# EAGLE design mapleCUL_small-V03_012 (EAGLE 9.1.1)
MAPLE-CUx Large Version
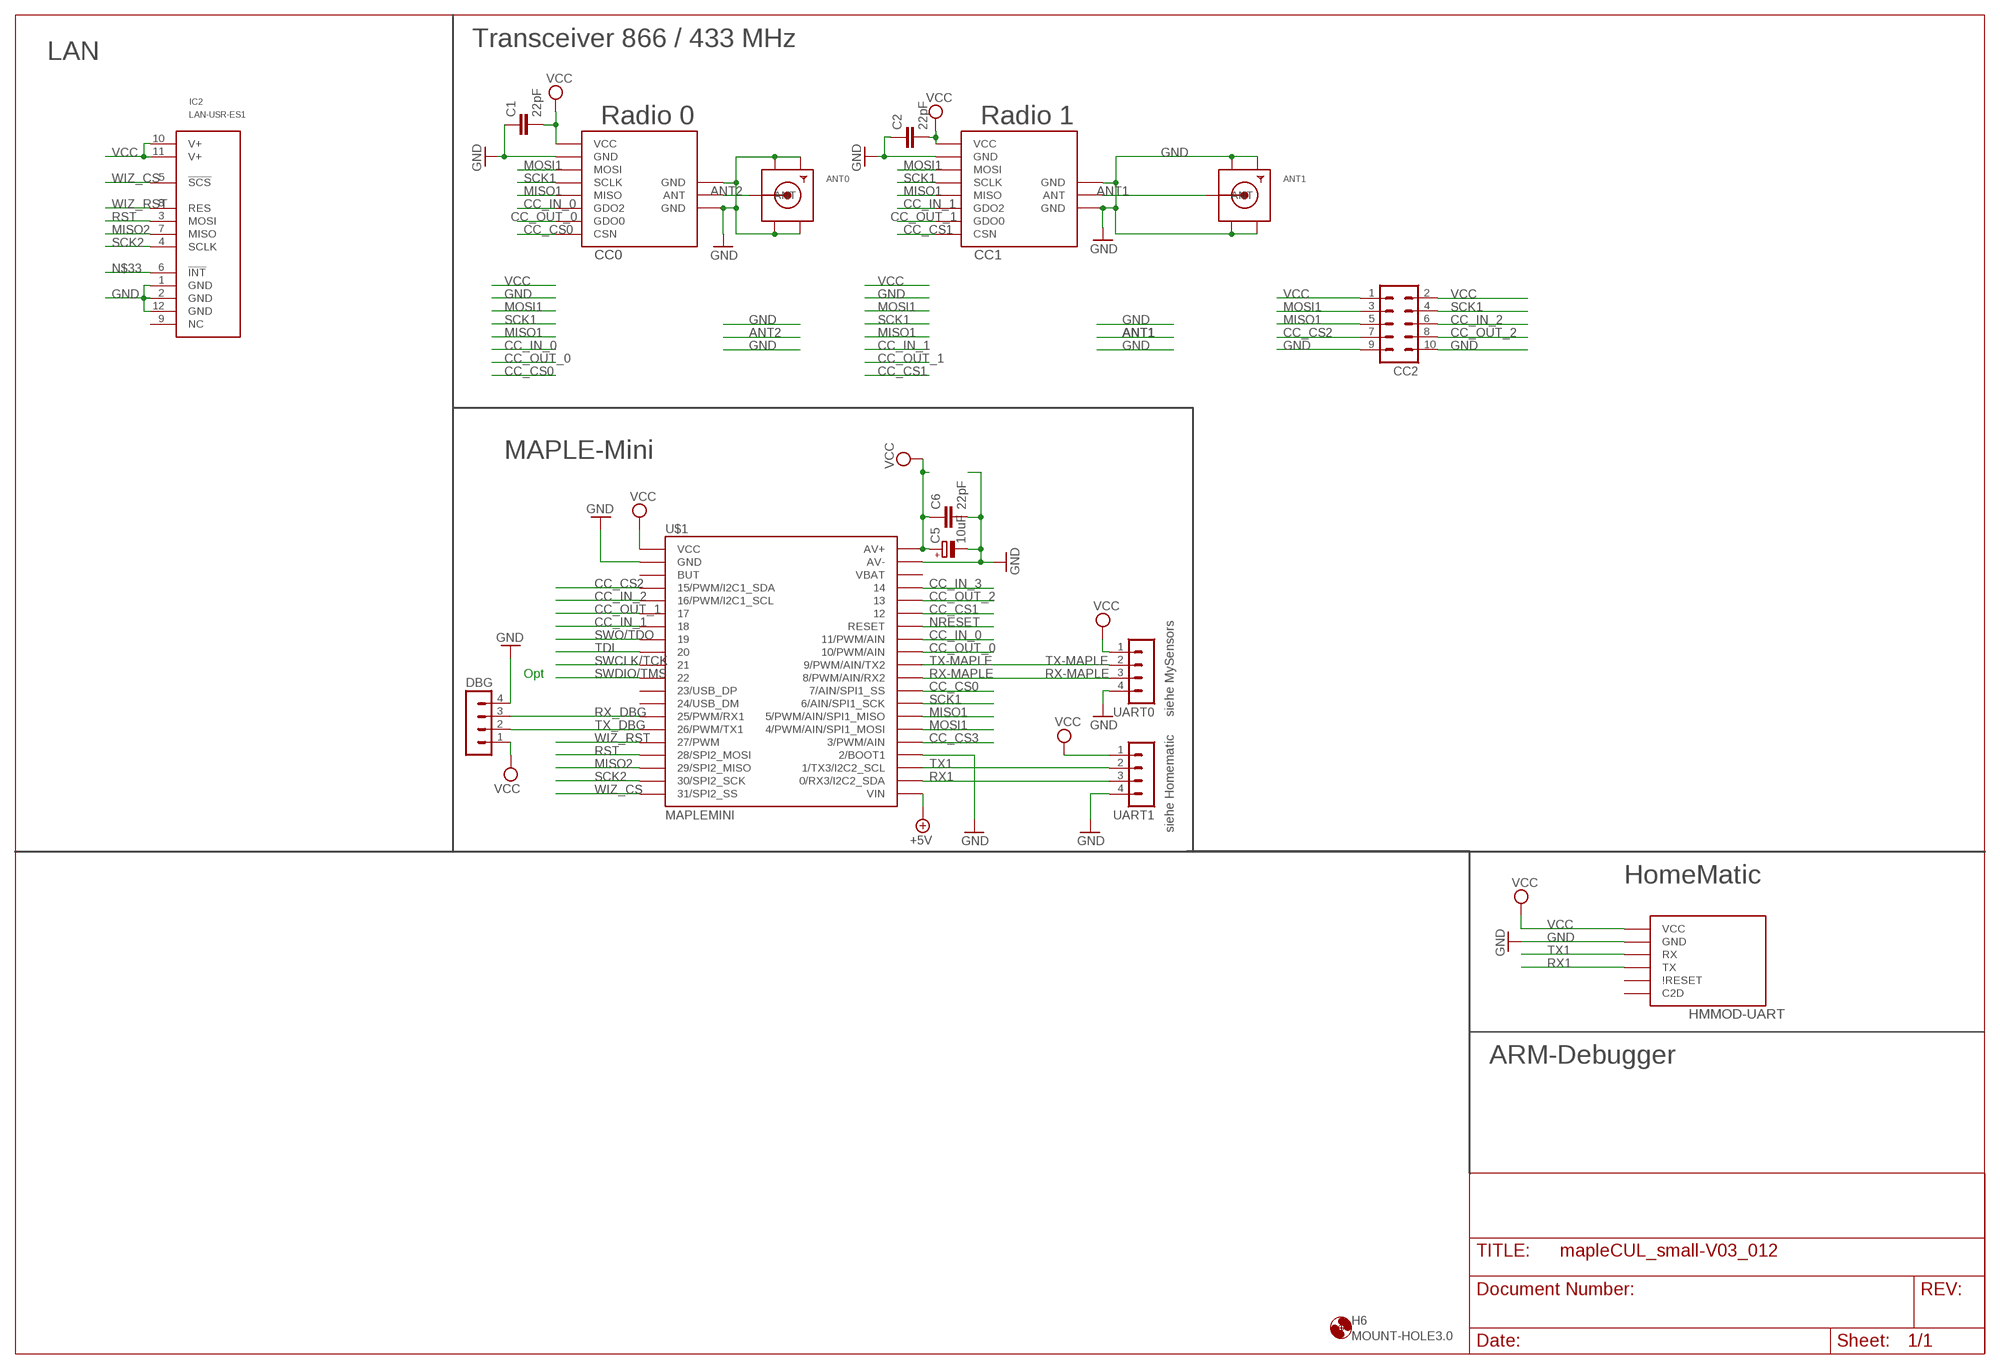
[diagram p0: schematic, sheet 1]

## Parts
ANT0  SMACONNECTOR_EDGE_UFL  [SMA_EDGELAUNCH_UFL]
ANT1  SMACONNECTOR_EDGE_UFL  [SMA_EDGELAUNCH_UFL]
C1  22pF  C-EUC0805  [C0805]
C2  22pF  C-EUC0805  [C0805]
C5  10uF  CPOL-EUR/2012-12W  [R/2012-12W]
C6  22pF  C-EUC0805  [C0805]
CC0  CC1101  CC1101_MODULE1SMD  [CC1101_MODULE1_SMD]
CC1  CC1101_MODULE1SMD  [CC1101_MODULE1_SMD]
CC2  MA05-2  [MA05-2]
DBG  MA04-1  [MA04-1]
H6  MOUNT-HOLE3.0  [3,0]
HMMOD-UART  HM-MOD-UARTDIL  [HM-MOD-UART-DIL]
IC2  LAN-USR-ES1  [USR-ES1]
U$1  MAPLEMINI  [20-DIP]
UART0  MA04-1  [MA04-1]
UART1  MA04-1  [MA04-1]

## Nets
+5V [PWR]: U$1.21(VIN)
ANT1 [PWR]: ANT1.P(ANT) CC1.ANT
ANT2: ANT0.P(ANT) CC0.ANT
CC_CS0: CC0.CSN U$1.29(7/AIN/SPI1_SS)
CC_CS1: CC1.CSN U$1.35
CC_CS2: CC2.7 U$1.4(15/PWM/I2C1_SDA)
CC_CS3: U$1.25(3/PWM/AIN)
CC_IN_0: CC0.GDO2 U$1.33(11/PWM/AIN)
CC_IN_1: CC1.GDO2 U$1.7
CC_IN_2: CC2.6 U$1.5(16/PWM/I2C1_SCL)
CC_IN_3: U$1.37
CC_OUT_0: CC0.GDO0 U$1.32(10/PWM/AIN)
CC_OUT_1: CC1.GDO0 U$1.6
CC_OUT_2: CC2.8 U$1.36
GND [PWR]: ANT0.GND@1(GND1) ANT0.GND@2(GND2) ANT0.GND@3(GND3) ANT0.GND@4(GND4) ANT1.GND@1(GND1) ANT1.GND@2(GND2) ANT1.GND@3(GND3) ANT1.GND@4(GND4) C1.1 C2.1 C5.- C6.2 CC0.GND@0(GND) CC0.GND@1(GND) CC0.GND@2(GND) CC1.GND@0(GND) CC1.GND@1(GND) CC1.GND@2(GND) CC2.9 CC2.10 DBG.4 HMMOD-UART.2(GND) IC2.1(GND) IC2.2(GND) IC2.12(GND) U$1.2(GND) U$1.24(2/BOOT1) U$1.39(AV-) UART0.4 UART1.4
MISO1: CC0.MISO CC1.MISO CC2.5 U$1.27(5/PWM/AIN/SPI1_MISO)
MISO2: IC2.7(MISO) U$1.18(29/SPI2_MISO)
MOSI1: CC0.MOSI CC1.MOSI CC2.3 U$1.26(4/PWM/AIN/SPI1_MOSI)
N$33: IC2.6(!INT!)
NRESET: U$1.34(RESET)
RST: IC2.3(MOSI) U$1.17(28/SPI2_MOSI)
RX1: HMMOD-UART.5(TX) U$1.22(0/RX3/I2C2_SDA) UART1.3
RX-MAPLE: U$1.30(8/PWM/AIN/RX2) UART0.3
RX_DBG: DBG.3 U$1.14(25/PWM/RX1)
SCK1: CC0.SCLK CC1.SCLK CC2.4 U$1.28(6/AIN/SPI1_SCK)
SCK2: IC2.4(SCLK) U$1.19(30/SPI2_SCK)
SWCLK/TCK: U$1.10
SWDIO/TMS: U$1.11
SWO/TDO: U$1.8
TDI: U$1.9
TX1: HMMOD-UART.6(RX) U$1.23(1/TX3/I2C2_SCL) UART1.2
TX-MAPLE: U$1.31(9/PWM/AIN/TX2) UART0.2
TX_DBG: DBG.2 U$1.15(26/PWM/TX1)
VCC [PWR]: C1.2 C2.2 C5.+ C6.1 CC0.VCC CC1.VCC CC2.1 CC2.2 DBG.1 HMMOD-UART.1(VCC) IC2.10(V+) IC2.11(V+) U$1.1(VCC) U$1.40(AV+) UART0.1 UART1.1
WIZ_CS: IC2.5(!SCS!) U$1.20(31/SPI2_SS)
WIZ_RST: IC2.8(RES) U$1.16(27/PWM)
Unconnected: HMMOD-UART.3(C2D) HMMOD-UART.4(\!RESET) IC2.9(NC) U$1.3(BUT) U$1.12(23/USB_DP) U$1.13(24/USB_DM) U$1.38(VBAT)

## Notes on the sheet
- Transceiver 866 / 433 MHz
- LAN
- Radio 0 | Radio 1
- MAPLE-Mini
- Opt
- siehe MySensors
- siehe Homematic
- HomeMatic
- ARM-Debugger

## Library data of the parts
ANT0 ANT1 = adafruit:SMACONNECTOR: SMA Connector 90° DIP SMA Connector, 50 Ohm (4UConnector: 07259)
C1 C2 C6 = rcl:C-EU: CAPACITOR, European symbol
C5 = rcl:CPOL-EU: POLARIZED CAPACITOR, European symbol
CC0 CC1 = wireless:CC1101_MODULE1: CC1101 wireless module for 433/868 MHz (sold from Aliexpress). DIL version for mounting with pin header (and SMD soldering) and SMD only variant available.
CC2 = con-lstb:MA05-2: PIN HEADER; OC_FARNELL: unknown; OC_NEWARK: unknown
DBG UART0 UART1 = con-lstb:MA04-1: PIN HEADER; OC_FARNELL: unknown; OC_NEWARK: unknown
H6 = holes:MOUNT-HOLE: MOUNTING HOLE with drill center marker
HMMOD-UART = wireless:HM-MOD-UART: eQ3 HM-MOD-UART-AW-SH2 wireless module for 868 MHz. DIL version for mounting with pin header (antenna upwards) and SMD variant available (antenna downwards).
IC2 = Martin-Communication:LAN-USR-ES1
U$1 = maplemini-small:MAPLEMINI

## Net classes
0 default: width 0.305 mm
1 PWR: width 0.406 mm

## Board
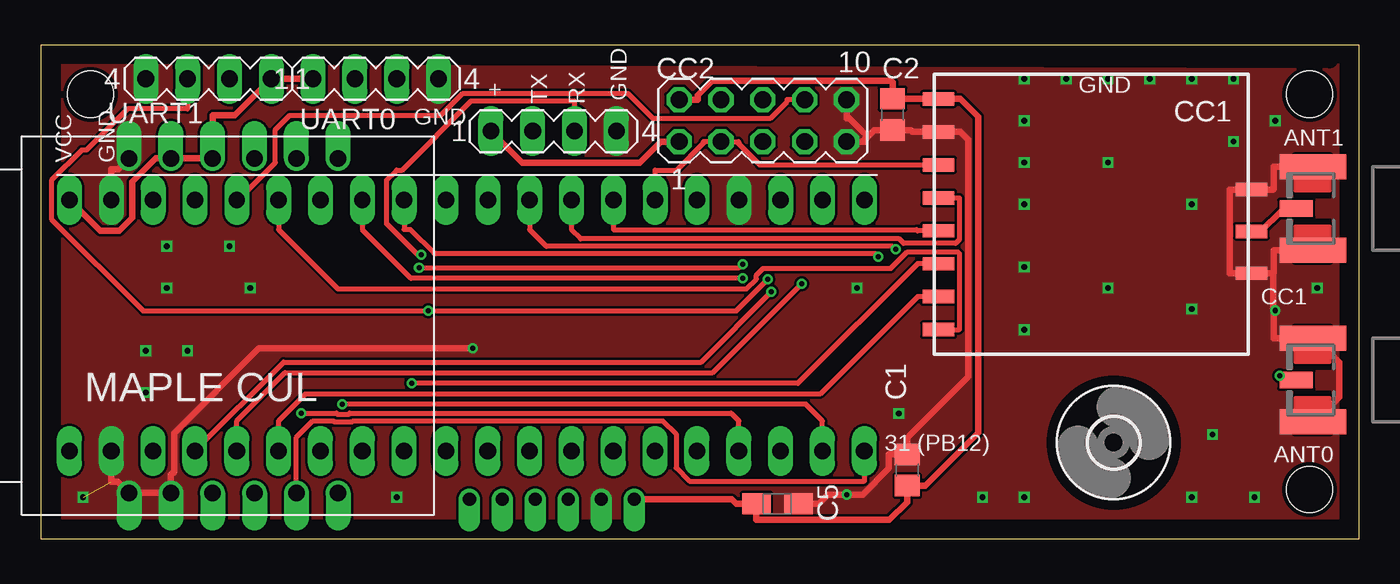
[diagram p1: board, top side]
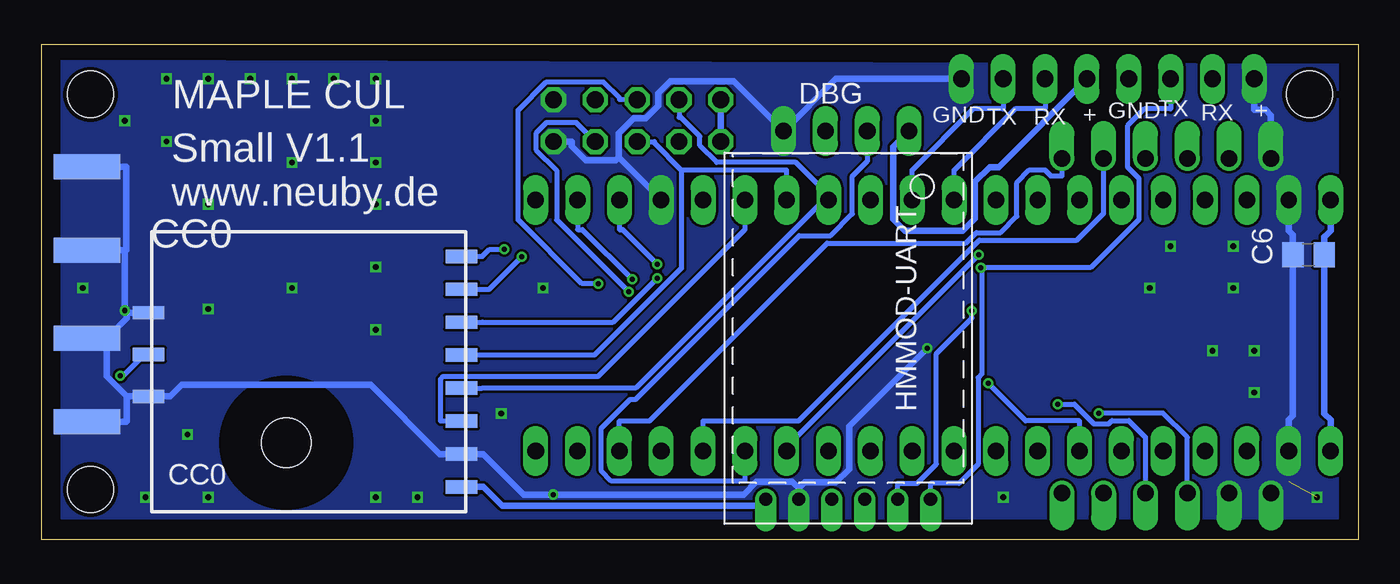
[diagram p2: board, bottom side, seen from below]

Size 80 x 30 mm. Coordinates in mm from the lower left corner, seen from the top.
Outline: 0,0 0,30 80,30 80,0 1,0 0,0
Copper layers (1*16): Top 0.035mm / dielectric 1.5mm / Bottom 0.035mm
Design rules "Fusion_eagle_rule_v1.1": minimum track width 6mil, minimum drill 12mil, track to track 6mil, track to pad 6mil, pad to pad 6mil, via to via 6mil, smd to smd 0mil, copper to edge 10mil, drill to drill 10mil, minimum pad ring 10mil, minimum via ring 6mil, stop-mask expansion 2mil, vias tented up to drill 100mil, thermal gap 10mil
Holes 2.8 mm at 3,27 77,27 77,3
tRestrict: 1 lines
bRestrict: 1 lines

### Footprints (pad centres in the part's own frame; a part is rotated, then mirrored left to right if it is on the bottom)
SMA_EDGELAUNCH_UFL = smd 4.064 x 1.524: GND@1 2.032,-2.54; GND@2 2.032,2.54 | smd 4.064 x 1.524 bottom: GND@3 2.032,2.54; GND@4 2.032,-2.54 | smd 2.032 x 1.016: P 3.048,0
C0805 = smd 1.3 x 1.5: 1 -0.95,0; 2 0.95,0
R/2012-12W = smd 1.75 x 1.26: + 1.275,0; - -1.275,0
CC1101_MODULE1_SMD = smd 1.93 x 0.813: ANT 19,5.96; CSN 0,0; GDO0 0,2; GDO2 0,4; GND@0 0,12; GND@1 19,8.5; GND@2 19,3.42; MISO 0,6; MOSI 0,10; SCLK 0,8; VCC 0,14
MA05-2 = drill 1.016 octagon: 1 -5.08,-1.27; 2 -5.08,1.27; 3 -2.54,-1.27; 4 -2.54,1.27; 5 0,-1.27; 6 0,1.27; 7 2.54,-1.27; 8 2.54,1.27; 9 5.08,-1.27; 10 5.08,1.27
MA04-1 = drill 1.016 long: 1 -3.81,0; 2 -1.27,0; 3 1.27,0; 4 3.81,0
3,0 = hole 3: 0,0
HM-MOD-UART-DIL = drill 0.8 offset: 1 0,12; 2 0,10; 3 0,8; 4 0,6; 5 0,4; 6 0,2
USR-ES1 = drill 1 pad 1.35 offset: 1 -10.16,5.715; 2 -10.16,3.175; 3 -10.16,0.635; 4 -10.16,-1.905; 5 -10.16,-4.445; 6 -10.16,-6.985; 7 10.16,-6.985; 8 10.16,-4.445; 9 10.16,-1.905; 10 10.16,0.635; 11 10.16,3.175; 12 10.16,5.715
20-DIP = drill 1.016 pad 1.27 long: 1 -24.13,-7.62; 2 -21.59,-7.62; 3 -19.05,-7.62; 4 -16.51,-7.62; 5 -13.97,-7.62; 6 -11.43,-7.62; 7 -8.89,-7.62; 8 -6.35,-7.62; 9 -3.81,-7.62; 10 -1.27,-7.62; 11 1.27,-7.62; 12 3.81,-7.62; 13 6.35,-7.62; 14 8.89,-7.62; 15 11.43,-7.62; 16 13.97,-7.62; 17 16.51,-7.62; 18 19.05,-7.62; 19 21.59,-7.62; 20 24.13,-7.62 | drill 1 pad 1.27 long: 21 24.13,7.62; 22 21.59,7.62; 23 19.05,7.62; 24 16.51,7.62; 25 13.97,7.62; 26 11.43,7.62; 27 8.89,7.62; 28 6.35,7.62; 29 3.81,7.62; 30 1.27,7.62; 31 -1.27,7.62; 32 -3.81,7.62; 33 -6.35,7.62; 34 -8.89,7.62; 35 -11.43,7.62; 36 -13.97,7.62; 37 -16.51,7.62; 38 -19.05,7.62; 39 -21.59,7.62; 40 -24.13,7.62

### Placement (x,y rotation side)
ANT0  79.25,9.65 180 top
ANT1  79.25,20.07 180 top
C1  52.58,4.19 270 top
C2  51.69,25.78 90 top
C5  44.7,2.14 180 top
C6  3.05,17.26 180 bottom
CC0  54.48,17.16 180 bottom
CC1  54.48,12.72 0 top
CC2  43.81,25.4 0 top
DBG  31.11,24.77 0 top
H6  65.11,5.85 0 top
HMMOD-UART  24,2.41 90 bottom
IC2  11.05,12.95 90 top
U$1  25.84,12.97 0 top
UART0  20.32,27.94 0 top
UART1  10.16,27.94 180 top

### Tracks (layer width: path | path; a pad name or v marks a point on that pad's centre or on a via)
ANT1
  Top 0.406: CC1.ANT 74.05,18.68 75.31,19.94 76.07,19.94 ANT1.P
ANT2  (via drill 0.3 pad 0.61)
  Top 0.305: v75.21,9.91 75.95,9.91 ANT0.P
  Bottom 0.305: v75.21,9.91 75.12,9.82 73.74,11.2 CC0.ANT
CC_CS0  (via drill 0.3 pad 0.61)
  Top 0.305: v51.87,17.59 51.7,17.76 30.67,17.76 29.65,18.78 U$1.29
  Bottom 0.305: v51.87,17.59 52.79,17.59 53.21,17.16 CC0.CSN
CC_CS1
  Top 0.305: CC1.CSN 55.75,12.72 55.75,17.33 55.66,17.43 52.6,17.43 51.6,16.43 43.83,16.43 43.42,16.02 43.42,15.78 42.82,15.18 18.01,15.18 14.41,18.78 U$1.35
CC_CS2  (via drill 0.3 pad 0.61)
  Top 0.305: U$1.4 14.73,10.74 40.07,10.74 v44.33,15
  Bottom 0.305: CC2.7 47.5,25.27 49.32,25.27 49.97,24.63 49.97,23.64 48.7,22.38 48.7,19.38 v44.33,15
CC_IN_0  (via drill 0.3 pad 0.61)
  Top 0.305: v42.61,15.83 22.44,15.83 19.49,18.78 U$1.33
  Bottom 0.305: v42.61,15.83 45.28,13.16 53.21,13.16 CC0.GDO2
CC_IN_1  (via drill 0.3 pad 0.61)
  Top 0.305: v22.5,9.45 45.94,9.45 53.21,16.72 CC1.GDO2
  Bottom 0.305: v22.5,9.45 20.23,7.18 16.95,7.18 U$1.7
CC_IN_2  (via drill 0.3 pad 0.61)
  Top 0.305: U$1.5 11.87,7.18 14.79,10.1 40.77,10.1 v46.18,15.51
  Bottom 0.305: CC2.6 44.88,26.67 44.88,26.78 45.86,27.76 49.33,27.76 51.05,26.04 51.05,19.38 47.18,15.51 v46.18,15.51
CC_OUT_0  (via drill 0.3 pad 0.61)
  Top 0.305: v50.83,17.14 50.66,17.31 23.88,17.31 22.41,18.78 22.04,18.78 U$1.32
  Bottom 0.305: v50.83,17.14 52.81,15.16 53.21,15.16 CC0.GDO0
CC_OUT_1
  Top 0.305: CC1.GDO0 53.21,14.72 47.29,8.79 16.03,8.79 14.41,7.18 U$1.6
CC_OUT_2
  Top 0.305: CC2.8 45.29,26.67 45.29,26.56 44.29,25.56 37.12,25.56 35.63,27.05 25.6,27.05 24.27,25.72 15.09,25.72 14.22,24.85 14.22,22.85 11.96,20.59 U$1.36
GND  (via drill 0.3 pad 0.61, 0.35)  (1 unrouted)
  Top 0.406: U$1.39 4.25,22.45 4.67,22.45 IC2.12 | 74.8,16.14 74.83,16.16 74.83,17.53 ANT1.GND@3 | 74.8,16.14 74.8,14.01 v74.94,13.87 74.83,13.77 74.83,12.19 ANT0.GND@1 77.33,12.19 78.8,10.72 78.8,8.6 77.31,7.11 ANT0.GND@2 | 74.8,16.14 CC1.GND@2 72.16,16.14 72.16,21.22 CC1.GND@1 74.8,21.22 74.83,21.24 74.83,22.61 ANT1.GND@1 | v26.21,11.58 13.21,11.58 8.06,6.43 8.06,4.09 7.87,3.9 IC2.2 IC2.1 4.66,3.47 4.25,3.47 U$1.2 | C5.- 47.21,2.14 47.77,2.7 v48.91,2.7 49.88,2.7 51.47,4.29 51.47,5.14 C1.1 52.58,6.15 56.28,9.85 56.28,24.23 55.8,24.72 CC1.GND@0 52.91,24.72 52.8,24.83 C2.1 50.58,24.83 50.19,24.43 | CC2.10 48.9,25.55 49.07,25.55 50.19,24.43 | 50.19,24.43 50.01,24.26 50.01,24.13 CC2.9
  Bottom 0.406: 74.94,17.53 74.83,17.53 74.83,22.61 ANT1.GND@1 | ANT1.GND@3 74.94,17.53 | 74.94,17.53 v74.94,13.87 74.8,13.74 | 76.02,12.19 74.8,13.41 74.8,13.74 | 74.8,8.66 76.02,9.88 76.02,12.19 | CC0.GND@2 74.8,13.74 | v26.21,11.58 30.95,6.85 30.95,4.25 31.75,3.45 33.63,3.45 34,3.07 | 34,3.07 34.4,3.47 36.58,3.47 37.34,2.7 v48.91,2.7 50.7,2.7 53.16,5.16 54.28,5.16 CC0.GND@0 55.8,5.16 60,9.36 71.47,9.36 72.16,8.66 CC0.GND@1 74.8,8.66 | UART0.4 31.75,27.94 DBG.4 37.95,27.8 41.8,27.8 42.55,27.05 42.55,26.32 43.31,25.55 44.02,25.55 44.94,24.63 44.94,23.17 | 44.94,23.17 45.1,23.01 46.93,23.01 47.78,23.86 47.78,24.13 CC2.9 | U$1.24 44.94,23.17 | ANT0.GND@2 74.83,7.11 74.8,7.14 74.8,8.66 | HMMOD-UART.2 34,3.07 | U$1.2 4.25,7.23 4,7.49 C6.2 4,18.47 4.25,18.73 U$1.39 | ANT0.GND@1 76.02,12.19 | UART1.4 6.35,26.06 5.66,26.06 5.33,25.73 IC2.12
  other vias: 2.54,2.54 6.35,8.89 6.35,11.43 8.89,11.43 7.62,15.24 7.62,17.78 11.43,17.78 12.7,15.24 21.59,2.54 52.07,7.62 49.53,15.24 59.69,16.51 59.69,20.32 59.69,22.86 59.69,25.4 59.69,27.94 62.23,27.94 64.77,27.94 67.31,27.94 69.85,27.94 72.39,27.94 74.93,25.4 77.47,15.24 59.69,12.7 69.85,13.97 72.39,24.13 69.85,20.32 71.12,6.35 73.66,2.54 69.85,2.54 59.69,2.54 57.15,2.54 64.77,15.24 64.77,22.86
  pour Top (no thermals): 1.27,29.21 78.74,29.21 78.74,1.27 1.27,1.27
  pour Bottom (no thermals): 1.27,29.21 78.74,29.21 78.74,1.27 1.27,1.27
MISO1
  Top 0.305: CC1.MISO 53.21,18.72 53.15,18.78 34.73,18.78 U$1.27
  Bottom 0.305: 41.13,22.4 42.75,24.02 42.75,24.13 CC2.5 | 41.13,22.4 34.73,22.4 U$1.27 | 41.13,22.4 41.13,16.44 46.41,11.16 CC0.MISO
MISO2
  Bottom 0.305: IC2.7 18.03,22.05 18.71,22.05 19.07,22.41 20,22.41 20.77,21.65 20.77,19.59 21.75,18.61 23.23,18.61 23.87,17.96 32.28,17.96 43.07,7.18 44.9,7.18 U$1.18
MOSI1
  Top 0.305: U$1.26 37.27,22.4 38.59,22.4 40.21,24.02 40.21,24.13 CC2.3 42.34,24.13 42.34,24 43.62,22.72 CC1.MOSI
  Bottom 0.305: U$1.26 37.27,18.78 46.18,9.87 55.59,9.87 55.75,9.71 55.75,7.16 CC0.MOSI
RST  (via drill 0.3 pad 0.61)
  Top 0.305: v15.79,7.64 17.93,7.64 18,7.58 18.67,7.58 18.73,7.64 41.9,7.64 42.35,7.18 U$1.17
  Bottom 0.305: IC2.3 10.41,6.17 11.9,7.65 v15.78,7.65 v15.79,7.64
RX1  (via drill 0.3 pad 0.61)
  Top 0.305: v44.13,15.77 42.21,13.85 v23.5,13.85 6.19,13.85 0.62,19.42 0.62,21.77 2.45,23.61 2.75,23.61 5.25,26.11 8.89,26.11 UART1.3
  Bottom 0.305: v44.13,15.77 47.14,18.78 47.43,18.78 U$1.22 | v23.5,13.85 23.5,13.41 25.64,11.26 25.64,4.55 26.82,3.37 28,3.37 HMMOD-UART.5
RX-MAPLE
  Bottom 0.305: U$1.30 27.11,22.4 23.41,26.11 21.59,26.11 UART0.3
RX_DBG  (via drill 0.3 pad 0.61)
  Top 0.305: DBG.3 32.38,26.59 26.1,26.59 21.91,22.4 21.58,22.4 20.97,21.8 20.97,19.14 22.85,17.26 v23.07,17.26
  Bottom 0.305: U$1.14 34.73,5.59 v23.07,17.26
SCK1
  Top 0.305: U$1.28 32.19,18.78 32.75,18.22 52.1,18.22 52.37,17.95 55.52,17.95 55.75,18.18 55.75,20.72 CC1.SCLK
  Bottom 0.305: CC2.4 41.27,25.6 41.16,25.6 40.01,24.44 40.01,23.88 38.99,22.86 34.18,22.86 32.19,20.87 | U$1.28 32.19,20.87 | 32.19,20.87 43.91,9.16 53.21,9.16 CC0.SCLK
SCK2  (via drill 0.3 pad 0.61)
  Top 0.305: v18.27,8.19 46.43,8.19 47.43,7.18 U$1.19
  Bottom 0.305: v18.27,8.19 17.27,8.19 16.08,7 15.19,7 14.99,7.19 13.96,7.19 12.95,6.18 IC2.4
TX1  (via drill 0.3 pad 0.61)
  Top 0.305: v22.94,16.47 42.37,16.47 v42.59,16.69
  Bottom 0.305: 22.88,16.47 v22.94,16.47 | 22.88,16.47 16.28,16.47 13.35,19.4 13.35,21.89 14.04,22.59 14.04,25.08 13.02,26.11 11.43,26.11 UART1.2 | 22.88,16.47 22.88,10.03 23.11,9.8 23.11,4.53 24.27,3.37 26,3.37 HMMOD-UART.6 | v42.59,16.69 44.68,18.78 44.9,18.78 U$1.23
TX-MAPLE
  Bottom 0.305: U$1.31 24.57,22.4 20.87,26.11 19.05,26.11 UART0.2
TX_DBG
  Bottom 0.305: DBG.2 29.84,22.94 30.75,22.04 30.75,19.75 32.07,18.42 33.98,18.42 43.91,8.48 44.24,8.48 45.98,6.74 45.98,4.13 45.37,3.52 37.27,3.52 U$1.15
VCC
  Top 0.406: UART0.1 UART1.1 11.76,25.73 10.41,25.73 IC2.10 IC2.11 6.95,23.11 5.52,21.69 5.52,19.5 4.74,18.72 3.59,18.72 U$1.40 | HMMOD-UART.1 41.93,2.41 42.2,2.14 C5.+ 43.43,1.16 51.5,1.16 52.58,2.23 C1.2 53.68,3.24 56.88,6.44 56.88,25.64 55.8,26.72 CC1.VCC 52.81,26.72 52.8,26.73 C2.2 51.69,27.74 51.6,27.83 40.73,27.83 39.85,26.95 39.85,26.67 CC2.2 | CC2.1 37.62,24.13 36.34,22.86 29.21,22.86 DBG.1
  Bottom 0.406: CC0.VCC 53.16,3.16 52.01,2 36.41,2 HMMOD-UART.1 | UART0.1 21.86,22.58 22.4,22.58 23.3,21.68 23.3,19.45 24.04,18.71 27.56,18.71 28.26,19.41 28.26,23.81 DBG.1 | U$1.40 1.71,18.73 2.08,18.36 2.1,18.36 C6.1 2.1,16.15 2.1,7.61 1.71,7.23 U$1.1 | CC2.1 CC2.2
WIZ_CS
  Top 0.305: IC2.5 15.49,6.17 16.5,7.18 17.74,7.18 17.8,7.12 18.86,7.12 18.92,7.18 37.75,7.18 38.54,6.38 38.54,4.33 39.35,3.52 49.97,3.52 U$1.20
WIZ_RST
  Bottom 0.305: IC2.8 15.49,19.78 17.12,18.15 23.04,18.15 34.01,7.18 39.81,7.18 U$1.16

### Text on the board
tNames: TX | RX | GND | + | GND | GND | VCC | GND | CC1 | MAPLE CUL | 31 (PB12)
bNames: + | RX | TX | GND | RX | MAPLE CUL | + | TX | GND | Small V1.1 / www.neuby.de | CC0